# Altium project shield.PrjPcb
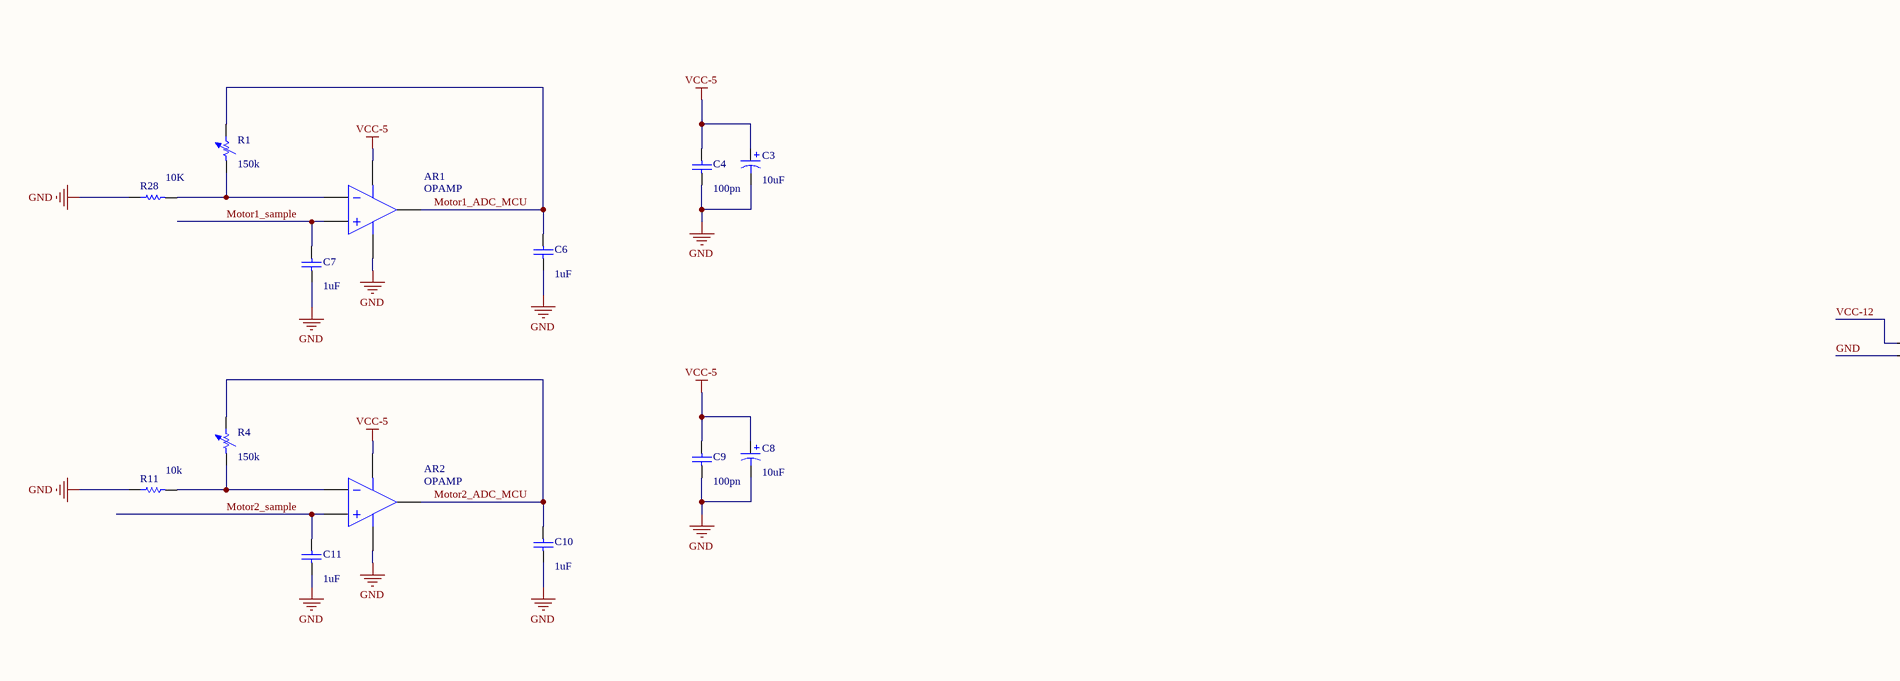
[diagram p0: shield.SchDoc, top left]
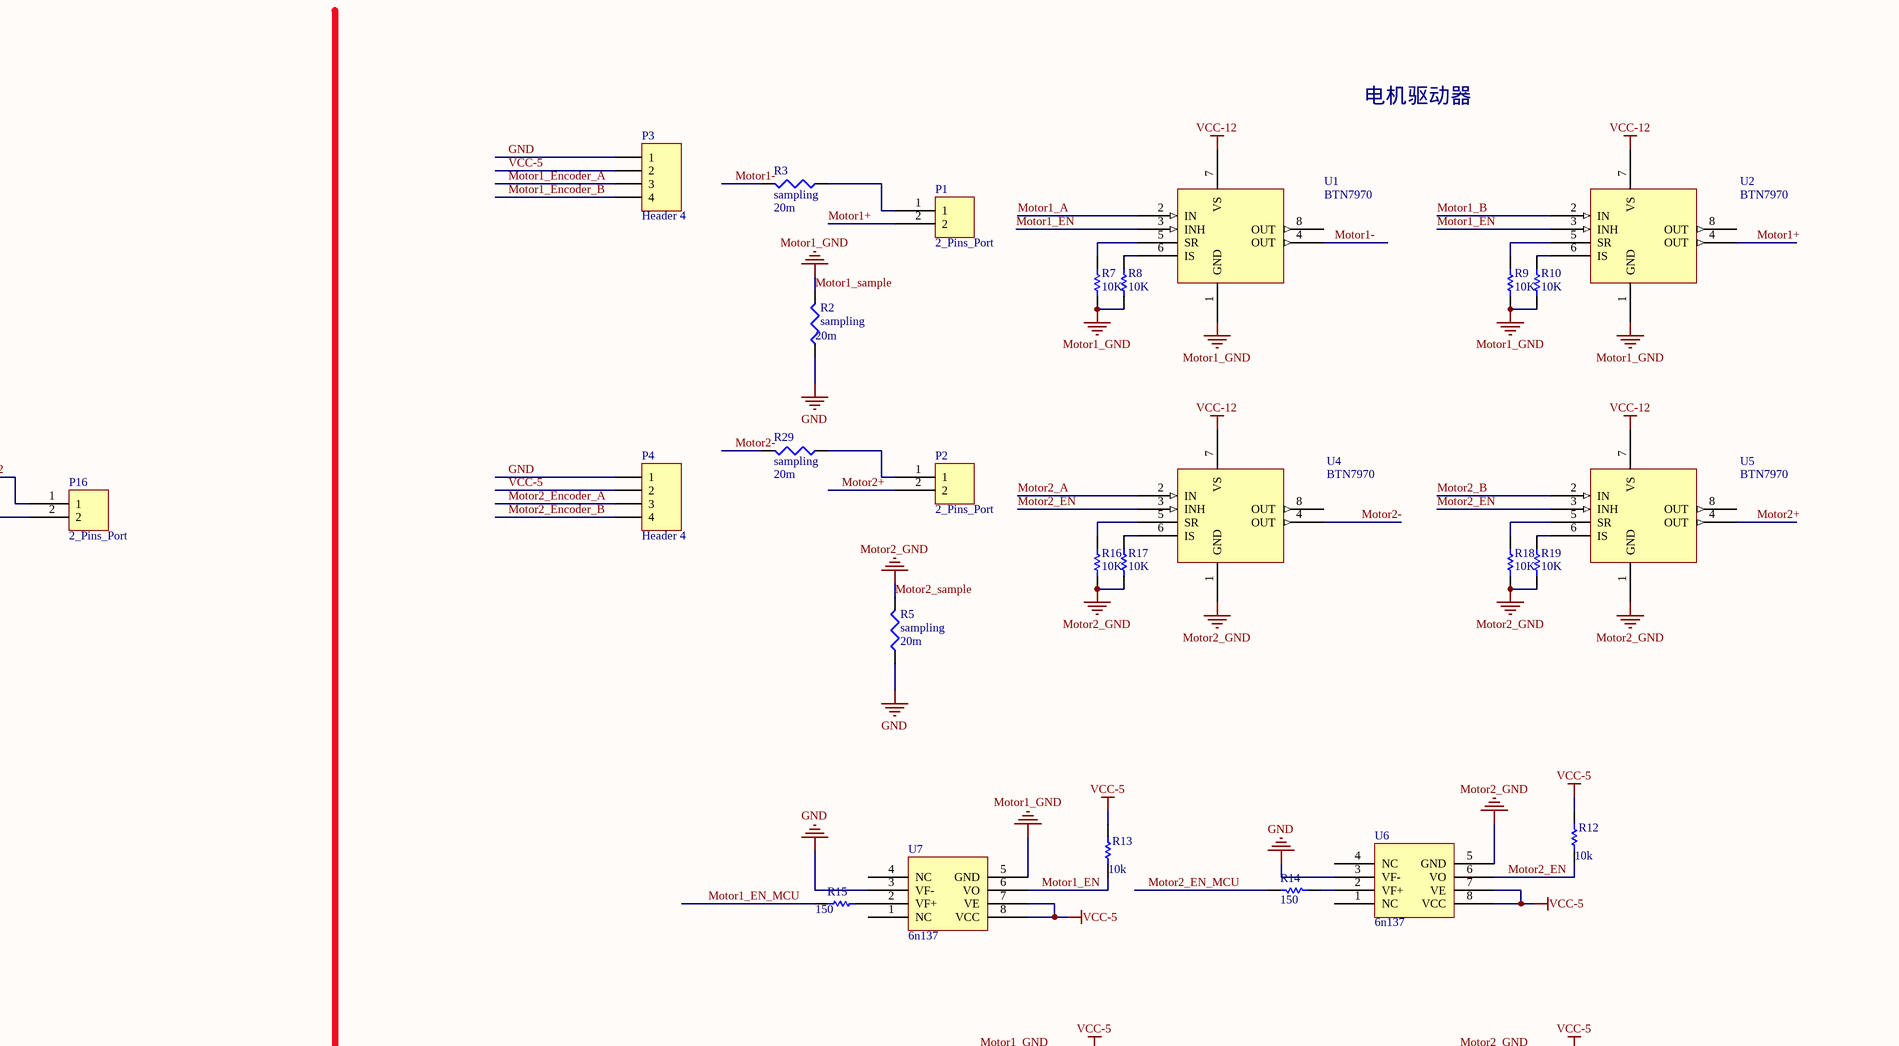
[diagram p1: shield.SchDoc, top right]
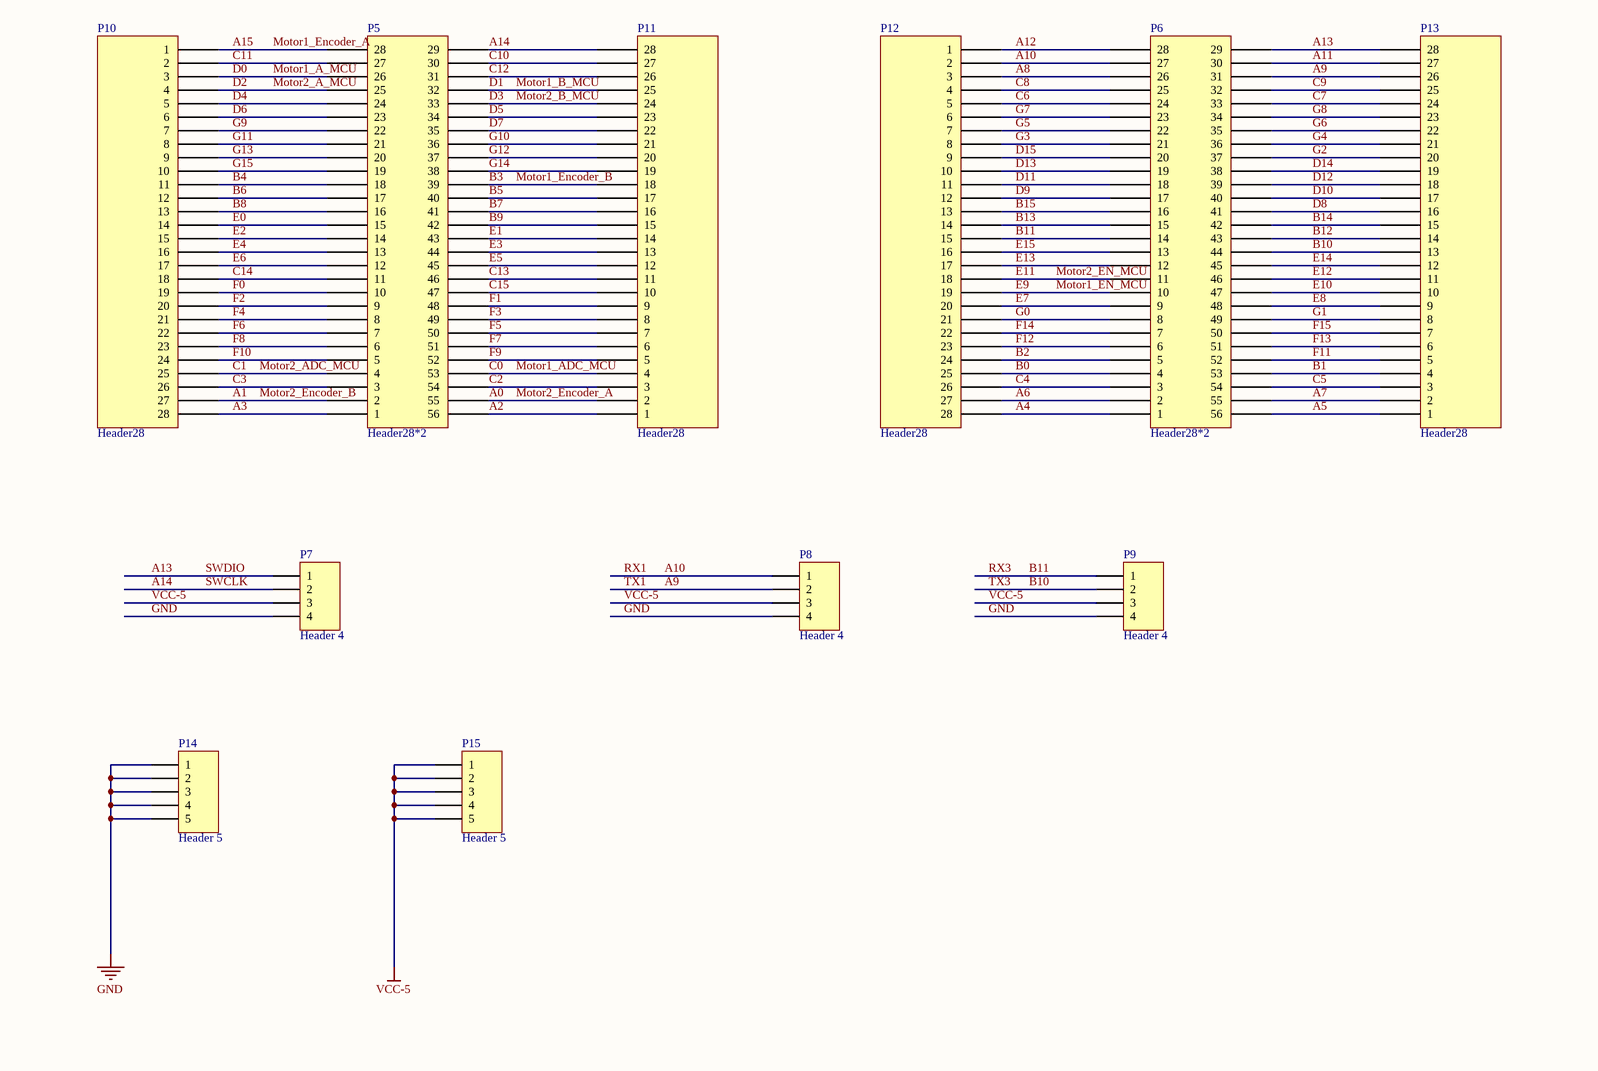
[diagram p2: shield.SchDoc, bottom left]
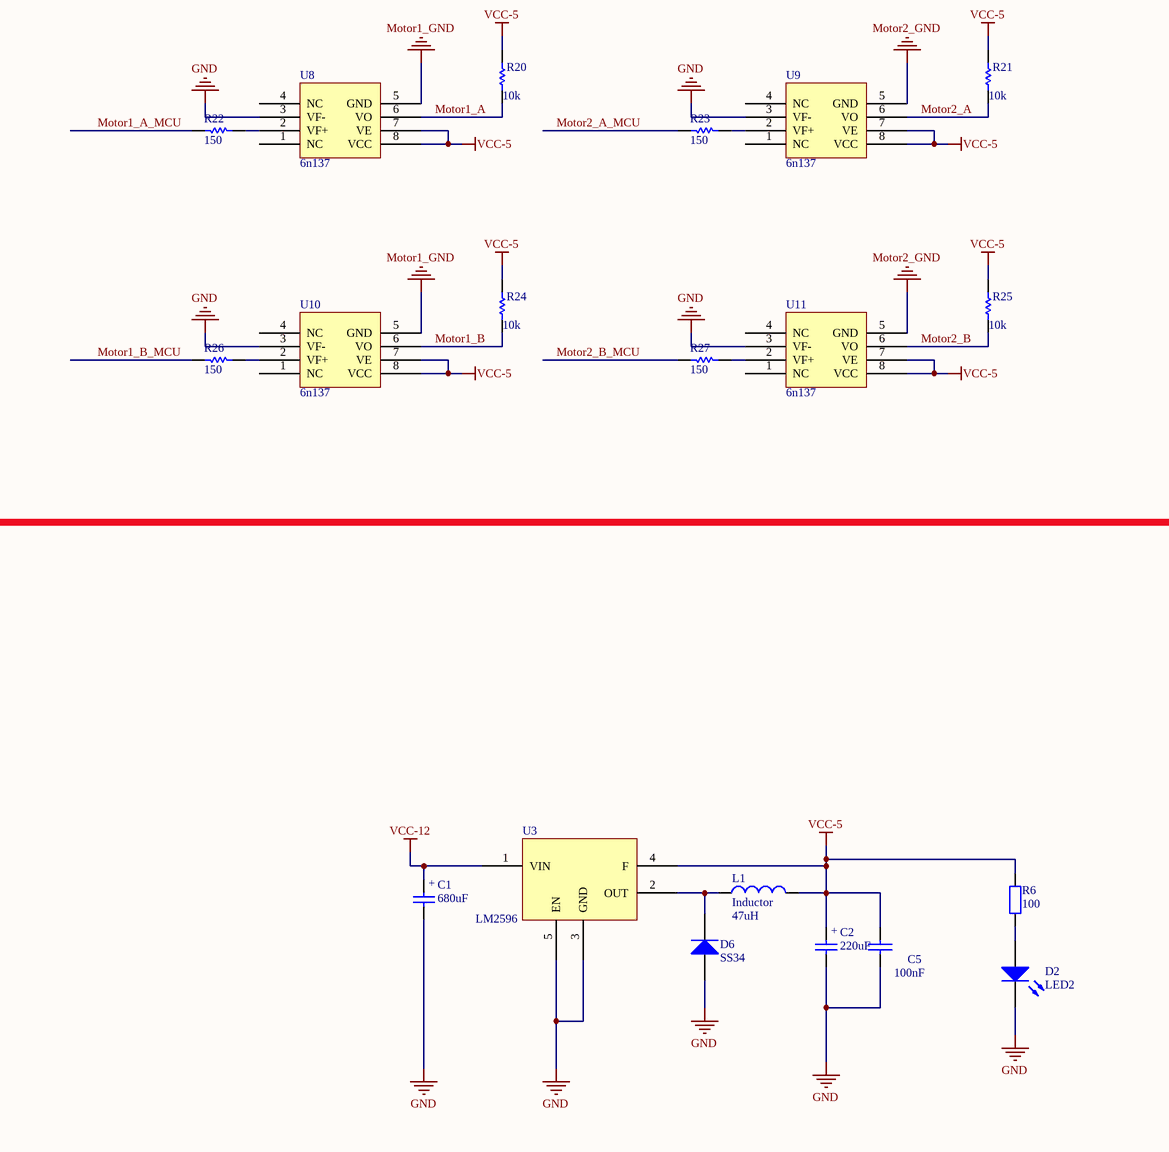
[diagram p3: shield.SchDoc, bottom right]
1 sheet, 72 parts. Net scope: global (net labels, ports and power ports of the same name join across sheets).
Board file: shield.PcbDoc

## Sheet shield.SchDoc
size A1

### Parts
AR1  OPAMP  [LC-SO-8_3.9mm]
AR2  OPAMP  [LC-SO-8_3.9mm]
C1  value 680uF  [CAP-7343]  (hidden comment: Cap)
C2  value 220uF  [CAP-7343]  (hidden comment: Cap)
C3  value 10uF  [CAP-3528]  (hidden comment: Cap Pol1)
C4  value 100pn  [CAP-0603]  (hidden comment: Cap)
C5  value 100nF  [CAP-0603]  (hidden comment: cap smd)
C6  value 1uF  [CAP-0603]  (hidden comment: Cap)
C7  value 1uF  [CAP-0603]  (hidden comment: Cap)
C8  value 10uF  [CAP-3528]  (hidden comment: Cap Pol1)
C9  value 100pn  [CAP-0603]  (hidden comment: Cap)
C10  value 1uF  [CAP-0603]  (hidden comment: Cap)
C11  value 1uF  [CAP-0603]  (hidden comment: Cap)
D2  LED2  [D2012[0805]]
D6  SS34  [LC-SMB(DO-214AA)_S3]
L1  Inductor  value 47uH  [Inductor1207]
P1  2_Pins_Port  [WJ2EDGV-5.08-2P]
P2  2_Pins_Port  [WJ2EDGV-5.08-2P]
P3  Header 4  [HDR1X4]
P4  Header 4  [HDR1X4]
P5  Header28*2  [HDR28*2]
P6  Header28*2  [HDR28*2]
P7  Header 4  [HDR1X4]
P8  Header 4  [HDR1X4]
P9  Header 4  [HDR1X4]
P10  Header28  [HDR28]
P11  Header28  [HDR28]
P12  Header28  [HDR28]
P13  Header28  [HDR28]
P14  Header 5  [HDR1X5]
P15  Header 5  [HDR1X5]
P16  2_Pins_Port  [WJ2EDGV-5.08-2P]
R1  value 150k  [3266W]  (hidden comment: Res Adj1)
R2  sampling  value 20m  [6332[2512]]
R3  sampling  value 20m  [6332[2512]]
R4  value 150k  [3266W]  (hidden comment: Res Adj1)
R5  sampling  value 20m  [6332[2512]]
R6  value 100  [RES-0603]  (hidden comment: RES1)
R7  10K  [RES-0603]
R8  10K  [RES-0603]
R9  10K  [RES-0603]
R10  10K  [RES-0603]
R11  value 10k  [RES-0603]  (hidden comment: Res1)
R12  value 10k  [RES-0603]  (hidden comment: Res1)
R13  value 10k  [RES-0603]  (hidden comment: Res1)
R14  value 150  [RES-0603]  (hidden comment: Res1)
R15  value 150  [RES-0603]  (hidden comment: Res1)
R16  10K  [RES-0603]
R17  10K  [RES-0603]
R18  10K  [RES-0603]
R19  10K  [RES-0603]
R20  value 10k  [RES-0603]  (hidden comment: Res1)
R21  value 10k  [RES-0603]  (hidden comment: Res1)
R22  value 150  [RES-0603]  (hidden comment: Res1)
R23  value 150  [RES-0603]  (hidden comment: Res1)
R24  value 10k  [RES-0603]  (hidden comment: Res1)
R25  value 10k  [RES-0603]  (hidden comment: Res1)
R26  value 150  [RES-0603]  (hidden comment: Res1)
R27  value 150  [RES-0603]  (hidden comment: Res1)
R28  value 10K  [RES-0603]  (hidden comment: Res1)
R29  sampling  value 20m  [6332[2512]]
U1  BTN7970  [BTN7970]
U2  BTN7970  [BTN7970]
U3  LM2596  [LC-TO-263-5]
U4  BTN7970  [BTN7970]
U5  BTN7970  [BTN7970]
U6  6n137
U7  6n137
U8  6n137
U9  6n137
U10  6n137
U11  6n137

### Nets
GND: AR1.5(V-) AR2.5(V-) C1.2(-) C2.2(-) C3.2 C4.1 C5.2 C6.1 C7.1 C8.2 C9.1 C10.1 C11.1 D2.2(K) D6.1(A) P3.1 P4.1 P7.4 P8.4 P9.4 P14.1 P14.2 P14.3 P14.4 P14.5 P16.2 R2.1 R5.1 R11.1 R28.1 U3.3(GND) U3.5(EN) U6.3(VF-) U7.3(VF-) U8.3(VF-) U9.3(VF-) U10.3(VF-) U11.3(VF-)
Motor1_sample: AR1.2(IN+) C7.2 R2.2 R7.1 R8.1 R9.1 R10.1 U1.1(GND) U2.1(GND) U7.5(GND) U8.5(GND) U10.5(GND)  [also labelled Motor1_GND]
Motor2_sample: AR2.2(IN+) C11.2 R5.2 R16.1 R17.1 R18.1 R19.1 U4.1(GND) U5.1(GND) U6.5(GND) U9.5(GND) U11.5(GND)  [also labelled Motor2_GND]
VCC-5: AR1.4(V+) AR2.4(V+) C2.1(+) C3.1 C4.2 C5.1 C8.1 C9.2 L1.2 P3.2 P4.2 P7.3 P8.3 P9.3 P15.1 P15.2 P15.3 P15.4 P15.5 R6.2 R12.2 R13.2 R20.2 R21.2 R24.2 R25.2 U3.4(F) U6.7(VE) U6.8(VCC) U7.7(VE) U7.8(VCC) U8.7(VE) U8.8(VCC) U9.7(VE) U9.8(VCC) U10.7(VE) U10.8(VCC) U11.7(VE) U11.8(VCC)
VCC-12: C1.1(+) P16.1 U1.7(VS) U2.7(VS) U3.1(VIN) U4.7(VS) U5.7(VS)
A0: P4.3 P5.55 P11.2  [also labelled Motor2_Encoder_A]
A1: P4.4 P5.2 P10.27  [also labelled Motor2_Encoder_B]
A2: P5.56 P11.1
A3: P5.1 P10.28
A4: P6.1 P12.28
A5: P6.56 P13.1
A6: P6.2 P12.27
A7: P6.55 P13.2
A8: P6.26 P12.3
A9: P6.31 P8.2 P13.26  [also labelled TX1]
A10: P6.27 P8.1 P12.2  [also labelled RX1]
A11: P6.30 P13.27
A12: P6.28 P12.1
A13: P6.29 P7.1 P13.28  [also labelled SWDIO]
A14: P5.29 P7.2 P11.28  [also labelled SWCLK]
A15: P3.3 P5.28 P10.1  [also labelled Motor1_Encoder_A]
B0: P6.4 P12.25
B1: P6.53 P13.4
B2: P6.5 P12.24
B3: P3.4 P5.39 P11.18  [also labelled Motor1_Encoder_B]
B4: P5.18 P10.11
B5: P5.40 P11.17
B6: P5.17 P10.12
B7: P5.41 P11.16
B8: P5.16 P10.13
B9: P5.42 P11.15
B10: P6.44 P9.2 P13.13  [also labelled TX3]
B11: P6.14 P9.1 P12.15  [also labelled RX3]
B12: P6.43 P13.14
B13: P6.15 P12.14
B14: P6.42 P13.15
B15: P6.16 P12.13
C0: AR1.3(OUT) C6.2 P5.53 P11.4 R1.2  [also labelled Motor1_ADC_MCU]
C1: AR2.3(OUT) C10.2 P5.4 P10.25 R4.2  [also labelled Motor2_ADC_MCU]
C2: P5.54 P11.3
C3: P5.3 P10.26
C4: P6.3 P12.26
C5: P6.54 P13.3
C6: P6.24 P12.5
C7: P6.33 P13.24
C8: P6.25 P12.4
C9: P6.32 P13.25
C10: P5.30 P11.27
C11: P5.27 P10.2
C12: P5.31 P11.26
C13: P5.46 P11.11
C14: P5.11 P10.18
C15: P5.47 P11.10
D0: P5.26 P10.3 R22.2  [also labelled Motor1_A_MCU]
D1: P5.32 P11.25 R26.2  [also labelled Motor1_B_MCU]
D2: P5.25 P10.4 R23.2  [also labelled Motor2_A_MCU]
D3: P5.33 P11.24 R27.2  [also labelled Motor2_B_MCU]
D4: P5.24 P10.5
D5: P5.34 P11.23
D6: P5.23 P10.6
D7: P5.35 P11.22
D8: P6.41 P13.16
D9: P6.17 P12.12
D10: P6.40 P13.17
D11: P6.18 P12.11
D12: P6.39 P13.18
D13: P6.19 P12.10
D14: P6.38 P13.19
D15: P6.20 P12.9
E0: P5.15 P10.14
E1: P5.43 P11.14
E2: P5.14 P10.15
E3: P5.44 P11.13
E4: P5.13 P10.16
E5: P5.45 P11.12
E6: P5.12 P10.17
E7: P6.9 P12.20
E8: P6.48 P13.9
E9: P6.10 P12.19 R15.2  [also labelled Motor1_EN_MCU]
E10: P6.47 P13.10
E11: P6.11 P12.18 R14.2  [also labelled Motor2_EN_MCU]
E12: P6.46 P13.11
E13: P6.12 P12.17
E14: P6.45 P13.12
E15: P6.13 P12.16
F0: P5.10 P10.19
F1: P5.48 P11.9
F2: P5.9 P10.20
F3: P5.49 P11.8
F4: P5.8 P10.21
F5: P5.50 P11.7
F6: P5.7 P10.22
F7: P5.51 P11.6
F8: P5.6 P10.23
F9: P5.52 P11.5
F10: P5.5 P10.24
F11: P6.52 P13.5
F12: P6.6 P12.23
F13: P6.51 P13.6
F14: P6.7 P12.22
F15: P6.50 P13.7
G0: P6.8 P12.21
G1: P6.49 P13.8
G2: P6.37 P13.20
G3: P6.21 P12.8
G4: P6.36 P13.21
G5: P6.22 P12.7
G6: P6.35 P13.22
G7: P6.23 P12.6
G8: P6.34 P13.23
G9: P5.22 P10.7
G10: P5.36 P11.21
G11: P5.21 P10.8
G12: P5.37 P11.20
G13: P5.20 P10.9
G14: P5.38 P11.19
G15: P5.19 P10.10
Motor1+: P1.2 U2.4(OUT)
Motor1-: R3.2 U1.4(OUT)
Motor1_A: R20.1 U1.2(IN) U8.6(VO)
Motor1_B: R24.1 U2.2(IN) U10.6(VO)
Motor1_EN: R13.1 U1.3(INH) U2.3(INH) U7.6(VO)
Motor2+: P2.2 U5.4(OUT)
Motor2-: R29.2 U4.4(OUT)
Motor2_A: R21.1 U4.2(IN) U9.6(VO)
Motor2_B: R25.1 U5.2(IN) U11.6(VO)
Motor2_EN: R12.1 U4.3(INH) U5.3(INH) U6.6(VO)
NetAR1_1: AR1.1(IN-) R1.1 R28.2
NetAR2_1: AR2.1(IN-) R4.1 R11.2
NetD2_1: D2.1(A) R6.1
NetD6_2: D6.2(K) L1.1 U3.2(OUT)
NetP1_1: P1.1 R3.1
NetP2_1: P2.1 R29.1
NetR7_2: R7.2 U1.5(SR)
NetR8_2: R8.2 U1.6(IS)
NetR9_2: R9.2 U2.5(SR)
NetR10_2: R10.2 U2.6(IS)
NetR14_1: R14.1 U6.2(VF+)
NetR15_1: R15.1 U7.2(VF+)
NetR16_2: R16.2 U4.5(SR)
NetR17_2: R17.2 U4.6(IS)
NetR18_2: R18.2 U5.5(SR)
NetR19_2: R19.2 U5.6(IS)
NetR22_1: R22.1 U8.2(VF+)
NetR23_1: R23.1 U9.2(VF+)
NetR26_1: R26.1 U10.2(VF+)
NetR27_1: R27.1 U11.2(VF+)

Not connected (* = marked no-connect by the designer): U1 8(OUT); U2 8(OUT); U4 8(OUT); U5 8(OUT); U6 1(NC) 4(NC); U7 1(NC) 4(NC); U8 1(NC) 4(NC); U9 1(NC) 4(NC); U10 1(NC) 4(NC); U11 1(NC) 4(NC)

### Notes on the sheet
- 电机驱动器

### Library data of the parts
AR1 AR2 = OPAMP: Operational Amplifier; pin to pad: 1>2 2>3 3>6 4>7 5>4
C1 C2 = Cap Pol S: 贴片极性电容
C3 C8 = Cap Pol1: Polarized Capacitor (Radial); Published: 8-Jun-2000; LatestRevisionDate: 17-Jul-2002; LatestRevisionNote: Re-released for DXP Platform.; PackageReference: RB7.6-15; Publisher: Altium Limited; PackageDescription: Polarized Capacitor (Radial); 2 Leads
C4 C6 C7 C9-C11 = Cap: Capacitor; Published: 8-Jun-2000; LatestRevisionDate: 17-Jul-2002; LatestRevisionNote: Re-released for DXP Platform.; PackageReference: RAD-0.3; Publisher: Altium Limited; PackageDescription: Radial Cap, Thru-Hole; 2 Leads; 0.3 in Pin Spacing
C5 = CAP: 贴片无极性电容
D2 = LED2: Typical RED, GREEN, YELLOW, AMBER GaAs LED; Published: 8-Jun-2000; LatestRevisionDate: 17-Jul-2002; LatestRevisionNote: Re-released for DXP Platform.; PackageDocument: Feb-2002; PackageReference: 3.2X1.6X1.1; Publisher: Altium Limited
D6 = Diode 1N5400: 3 Amp General Purpose Rectifier; Published: 8-Jun-2000; LatestRevisionDate: 17-Jul-2002; LatestRevisionNote: Re-released for DXP Platform.; DatasheetVersion: 1998; PackageVersion: Aug-1999; PackageReference: DO-201AD; Publisher: Altium Limited; PackageDescription: Diode, Axial; Body 9.5 x 5.6 mm (LxDia. max), Lead Dia. 1.32 mm (max); ComponentLink1Description: Manufacturer Link; ComponentLink1URL: http://www.fairchildsemi.com/; ComponentLink2Description: Datasheet; ComponentLink2URL: http://www.fairchildsemi.com/ds/1N%2F1N5400.pdf
L1 = Inductor: Code_IEC: 1005; Published: 8-Jun-2000; LatestRevisionDate: 29-May-2009; LatestRevisionNote: IPC-7351 Footprint Added.; PackageReference: 0402-A; Publisher: Altium Limited; PackageDescription: Chip Inductor; Code_JEITA: 0402
P3 P4 P7-P9 = Header 4: Header, 4-Pin; LatestRevisionDate: 17-Jul-2002; LatestRevisionNote: Re-released for DXP Platform.; Publisher: Altium Limited
P14 P15 = Header 5: Header, 5-Pin; LatestRevisionDate: 17-Jul-2002; LatestRevisionNote: Re-released for DXP Platform.; Publisher: Altium Limited
R1 R4 = Res Adj1: Variable Resistor; Set Position: 0.5; Published: 8-Jun-2000; LatestRevisionDate: 17-Jul-2002; LatestRevisionNote: Re-released for DXP Platform.; PackageReference: AXIAL-0.7; Publisher: Altium Limited; PackageDescription: Axial Device, Thru-Hole; 2 Leads; 0.7 in Pin Spacing
R2 R3 R5 R29 = Res3: Resistor; Published: 8-Jun-2000; LatestRevisionDate: 29-May-2009; LatestRevisionNote: IPC-7351 Footprint Added.; PackageReference: J1-0603; Publisher: Altium Limited; PackageDescription: Chip Resistor
R7-R10 R16-R19 = res1: Resistor; Revision: July-2002: Re-released for DXP Platform.; Value: 10K
R11-R15 R20-R28 = Res1: Resistor; Published: 8-Jun-2000; LatestRevisionDate: 17-Jul-2002; LatestRevisionNote: Re-released for DXP Platform.; PackageReference: AXIAL-0.3; Publisher: Altium Limited; PackageDescription: Axial Device, Thru-Hole; 2 Leads; 0.3 in Pin Spacing
U1 U2 U4 U5 = BTN7970: pin to pad: 8>4